# Altium schematic sheet Pmic.SchDoc
size A4; Date: 2026/04/16; ApprovedBy: NA; Author: 邱上峯; CompanyName: JFM常裕富士機工; Engineer: 邱上峯; Revision: V1.0; SheetNumber: 6; SheetTotal: 8; Pcb Name: NA
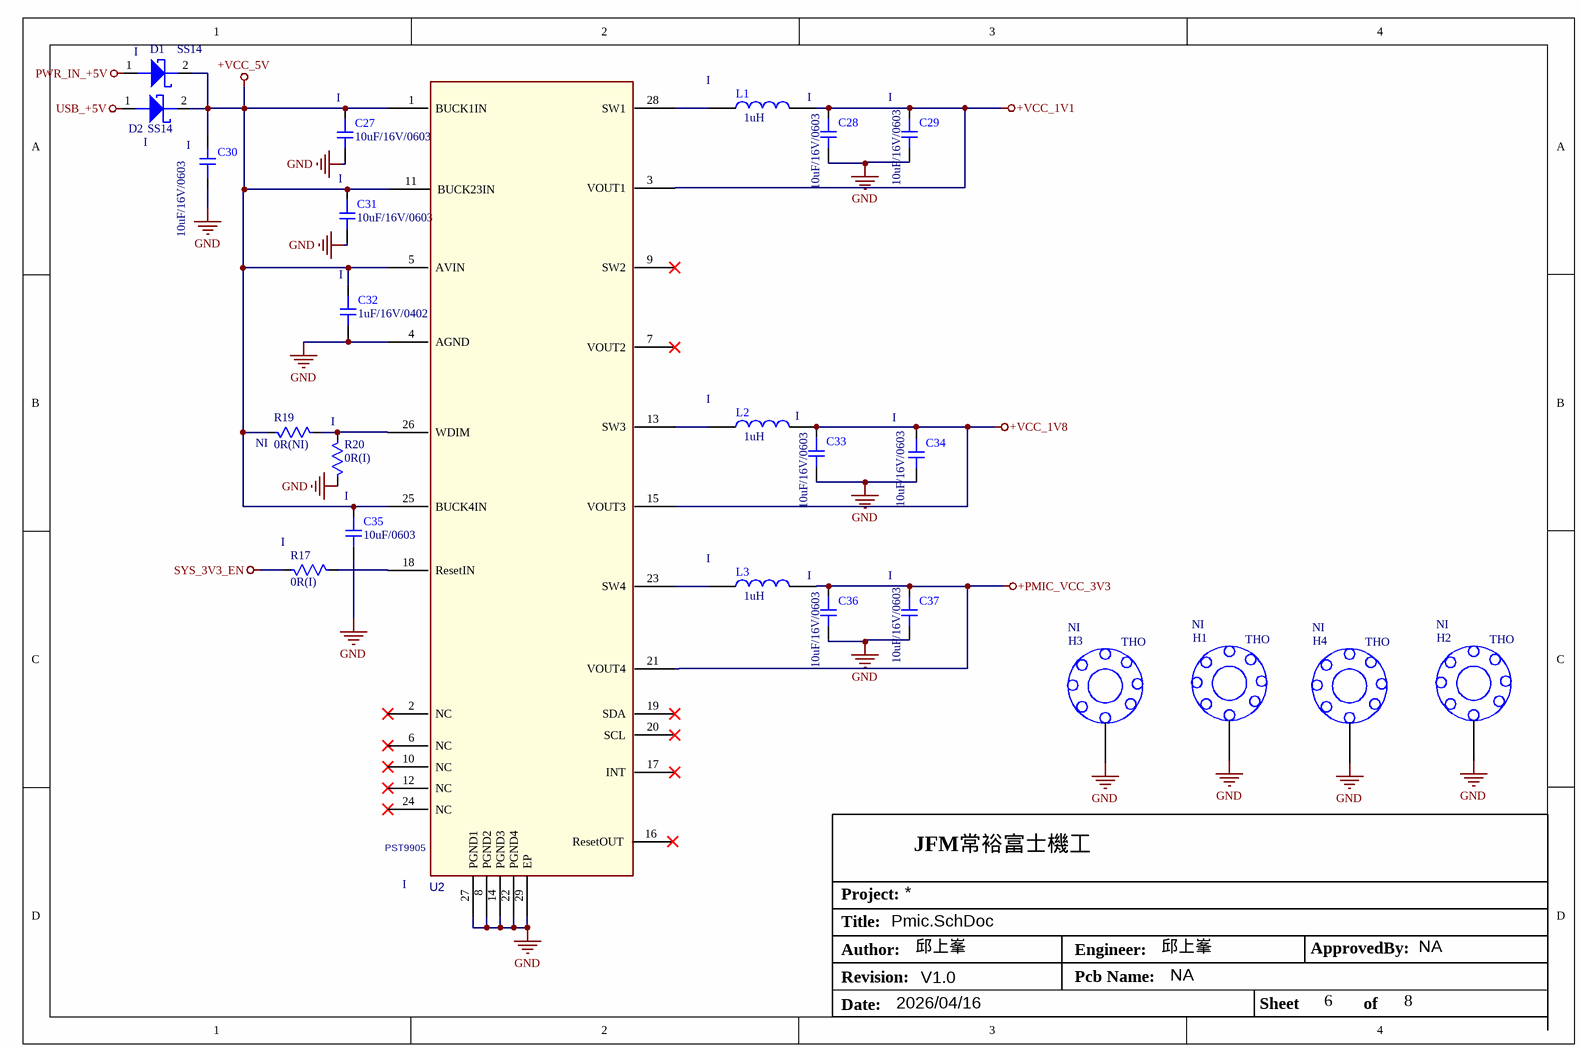
[diagram p0: Pmic.SchDoc]

## Parts
C27  10uF/16V/0603  BOM: I  [C0603]
C28  10uF/16V/0603  BOM: I  [C0603]
C29  10uF/16V/0603  BOM: I  [C0603]
C30  10uF/16V/0603  BOM: I  [C0603]
C31  10uF/16V/0603  BOM: I  [C0603]
C32  1uF/16V/0402  BOM: I  [C0402]
C33  10uF/16V/0603  BOM: I  [C0603]
C34  10uF/16V/0603  BOM: I  [C0603]
C35  10uF/0603  BOM: I  [C0603]
C36  10uF/16V/0603  BOM: I  [C0603]
C37  10uF/16V/0603  BOM: I  [C0603]
D1  SS14  BOM: I  [DO-214AC (SMA)]
D2  SS14  BOM: I  [DO-214AC (SMA)]
H1  THO  BOM: NI  [TPH-3.4mm]
H2  THO  BOM: NI  [TPH-3.4mm]
H3  THO  BOM: NI  [TPH-3.4mm]
H4  THO  BOM: NI  [TPH-3.4mm]
L1  1uH  BOM: I  [INDC2016X100N]
L2  1uH  BOM: I  [INDC2016X100N]
L3  1uH  BOM: I  [INDC2016X100N]
R17  0R(I)  BOM: I  [R0402]
R19  0R(NI)  BOM: NI  [R0402]
R20  0R(I)  BOM: I  [R0402]
U2  PST9905  BOM: I  [QFN 5X5 28PIN]

## Nets
+PMIC_VCC_3V3: C36.1 C37.1 L3.2 U2.21(VOUT4)
+VCC_1V1: C28.1 C29.1 L1.2 U2.3(VOUT1)
+VCC_1V8: C33.1 C34.1 L2.2 U2.15(VOUT3)
+VCC_5V: C27.1 C30.2 C31.1 C32.1 C35.1 D1.2(CATHODE) D2.2(CATHODE) R19.2 U2.1(BUCK1IN) U2.5(AVIN) U2.11(BUCK23IN) U2.25(BUCK4IN)
GND: C27.2 C28.2 C29.2 C30.1 C31.2 C32.2 C33.2 C34.2 C35.2 C36.2 C37.2 H1.0 H2.0 H3.0 H4.0 R20.1 U2.4(AGND) U2.8(PGND2) U2.14(PGND3) U2.22(PGND4) U2.27(PGND1) U2.29(EP)
PWR_IN_+5V: D1.1(ANODE)
SYS_3V3_EN: R17.2
USB_+5V: D2.1(ANODE)
NetL1_1: L1.1 U2.28(SW1)
NetL2_1: L2.1 U2.13(SW3)
NetL3_1: L3.1 U2.23(SW4)
NetR17_1: R17.1 U2.18(ResetIN)
NetR19_1: R19.1 R20.2 U2.26(WDIM)

Not connected (* = marked no-connect by the designer): U2 2(NC)* 6(NC)* 7(VOUT2)* 9(SW2)* 10(NC)* 12(NC)* 16(ResetOUT)* 17(INT)* 19(SDA)* 20(SCL)* 24(NC)*

## Notes on the sheet
- Title:
- Project:
- Date:
- Author:
- Revision:
- Engineer:
- Pcb Name:
- Sheet
- ApprovedBy:
- of

## Library data of the parts
C27-C37 = Cap
D1 D2 = DIODE SCHOTTKY: Schottky Diodes & Rectifiers 1A, 40V, Schottky Rectifier
L1-L3 = L: Code_IEC: 1005; Value: 10mH; Published: 8-Jun-2000; LatestRevisionDate: 29-May-2009; LatestRevisionNote: IPC-7351 Footprint Added.; PackageReference: 0402-A; Publisher: Altium Limited; PackageDescription: Chip Inductor; Code_JEITA: 0402
R17 R20 = Res: opt 0R
R19 = Res
U2 = PST9905: 4-Channel Power Management IC for Automotive System